# EAGLE design LMP848x Breakout v1.1 (EAGLE 8.3.2)
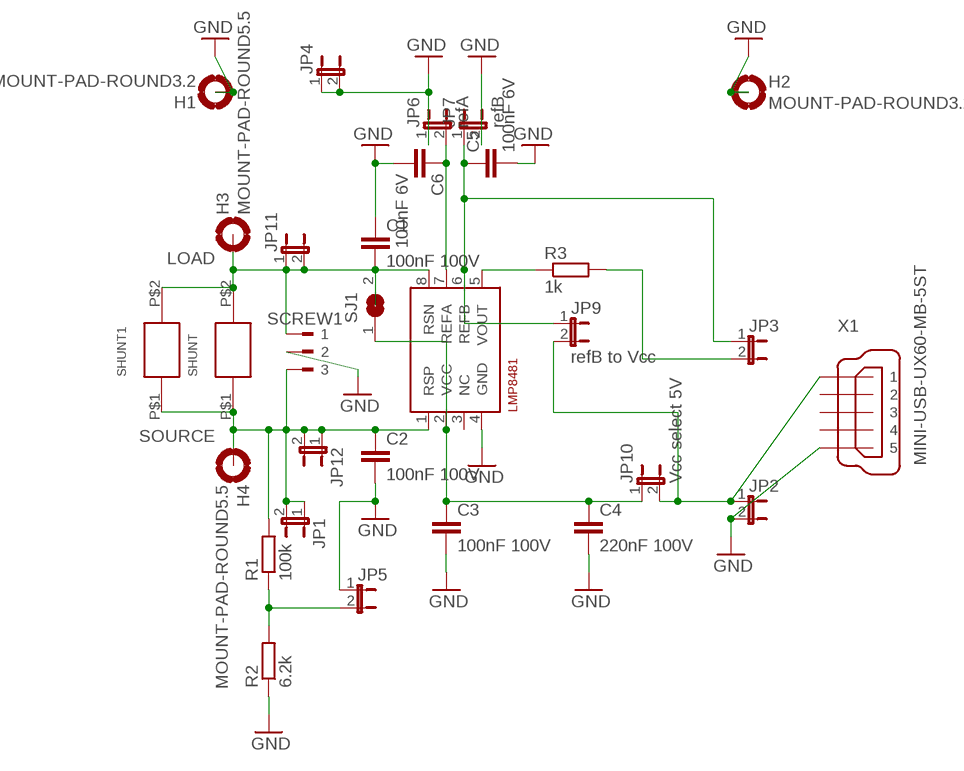
[diagram p0: schematic, sheet 1]

## Parts
C1  100nF 100V  C-EUC0805  [C0805]
C2  100nF 100V  C-EUC0805  [C0805]
C3  100nF 100V  C-EUC0805  [C0805]
C4  220nF 100V  C-EUC0805  [C0805]
C5  100nF 6V  C-EUC0805  [C0805]
C6  100nF 6V  C-EUC0805  [C0805]
H1  MOUNT-PAD-ROUND3.2  [3,2-PAD]
H2  MOUNT-PAD-ROUND3.2  [3,2-PAD]
H3  MOUNT-PAD-ROUND5.5  [5,5-PAD]
H4  MOUNT-PAD-ROUND5.5  [5,5-PAD]
JP1  JP1E  [JP1]
JP2  JP1E  [JP1]
JP3  JP1E  [JP1]
JP4  JP1E  [JP1]
JP5  JP1E  [JP1]
JP6  refA  JP1E  [JP1]
JP7  refB  JP1E  [JP1]
JP9  refB to Vcc  JP1E  [JP1]
JP10  Vcc select 5V  JP1E  [JP1]
JP11  JP1E  [JP1]
JP12  JP1E  [JP1]
LMP8481  LMP8481-H  [S-PDSO-G08]
R1  100k  R-EU_0207/7  [0207/7]
R2  6.2k  R-EU_0207/7  [0207/7]
R3  1k  R-EU_0204/5  [0204/5]
SCREW1  180-3  [180-3]
SHUNT  EBW_SERIES_15.2MM  [EBW_SERIES_15.2MM]
SHUNT1  EBW_SERIES_15.2MM  [EBW_SERIES_15.2MM]
SJ1  SJ  [SJ]
X1  MINI-USB-UX60-MB-5ST  [UX60-MB-5ST]

## Nets
GND: C1.1 C2.2 C3.2 C4.2 C5.2 C6.2 H1.B3,2(MOUNT) H2.B3,2(MOUNT) JP2.2 JP4.1 JP4.2 JP5.1 JP6.1 JP7.2 LMP8481.4(GND) R2.1 SCREW1.2 X1.5
LOAD: C1.2 H3.B5,5(MOUNT) JP11.1 JP11.2 LMP8481.8(RSN) SCREW1.1 SHUNT1.P$2 SHUNT.P$2 SJ1.2
N$1: C3.1 C4.1 JP10.1 LMP8481.2(VCC) SJ1.1
N$2: LMP8481.5(VOUT) R3.1
N$3: C5.1 JP3.1 JP7.1 JP9.1 LMP8481.6(REFB)
N$4: JP2.1 JP9.2 JP10.2 X1.1
N$5: JP3.2 R3.2
N$6: C6.1 JP6.2 LMP8481.7(REFA)
SOURCE: C2.1 H4.B5,5(MOUNT) JP1.1 JP1.2 JP12.1 JP12.2 LMP8481.1(RSP) R1.2 SCREW1.3 SHUNT1.P$1 SHUNT.P$1
VSENSE: JP5.2 R1.1 R2.2
Unconnected: LMP8481.3(NC) X1.2 X1.3 X1.4

## Library data of the parts
C1-C6 = rcl:C-EU: CAPACITOR, European symbol
H1-H4 = holes:MOUNT-PAD-ROUND: MOUNTING PAD, round
JP1-JP7 JP9-JP12 = jumper:JP1E: JUMPER
LMP8481 = LMP8481:LMP8481: LMP8481MM-H/NOPB 100V/V
R1-R3 = rcl:R-EU_: RESISTOR, European symbol
SCREW1 = con-weidmueller-sl35:180-3: WEIDMUELLER CLAMP CONNECTOR; OC_FARNELL: unknown; OC_NEWARK: unknown
SHUNT SHUNT1 = EBW series shunt:EBW_SERIES_15.2MM
SJ1 = jumper:SJ: SMD solder JUMPER
X1 = con-hirose:MINI-USB-: MINI USB Connector Source: http://www.hirose.co.jp/cataloge_hp/e24000019.pdf; OC_FARNELL: unknown; OC_NEWARK: unknown

## Net classes
2 thin_power: width 0.254 mm

## Board
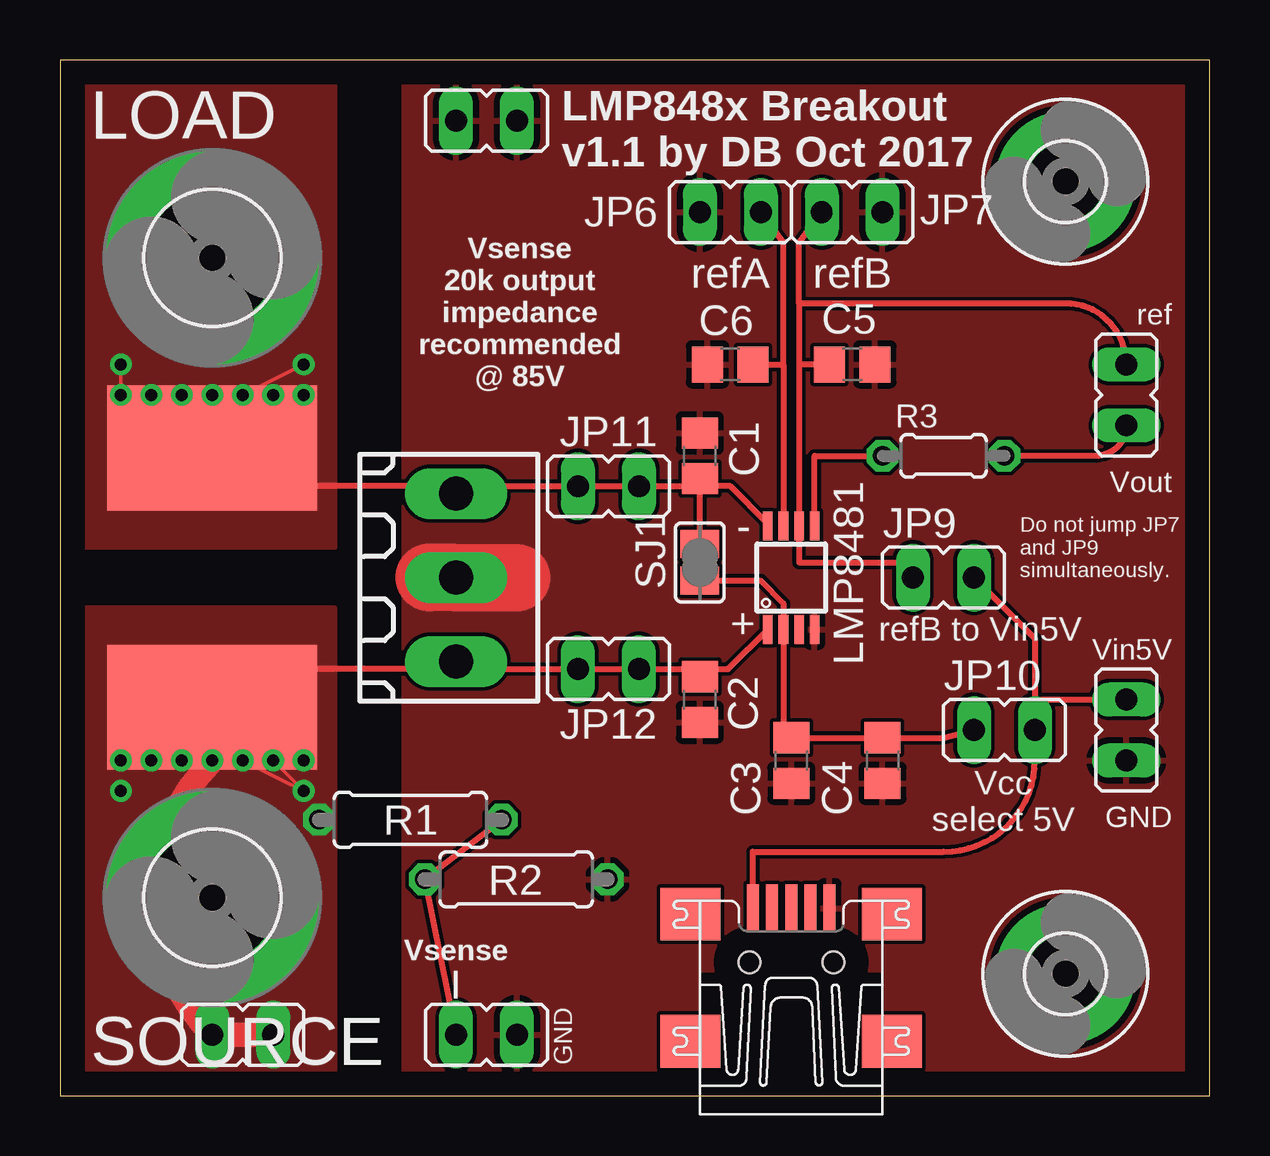
[diagram p1: board, top side]
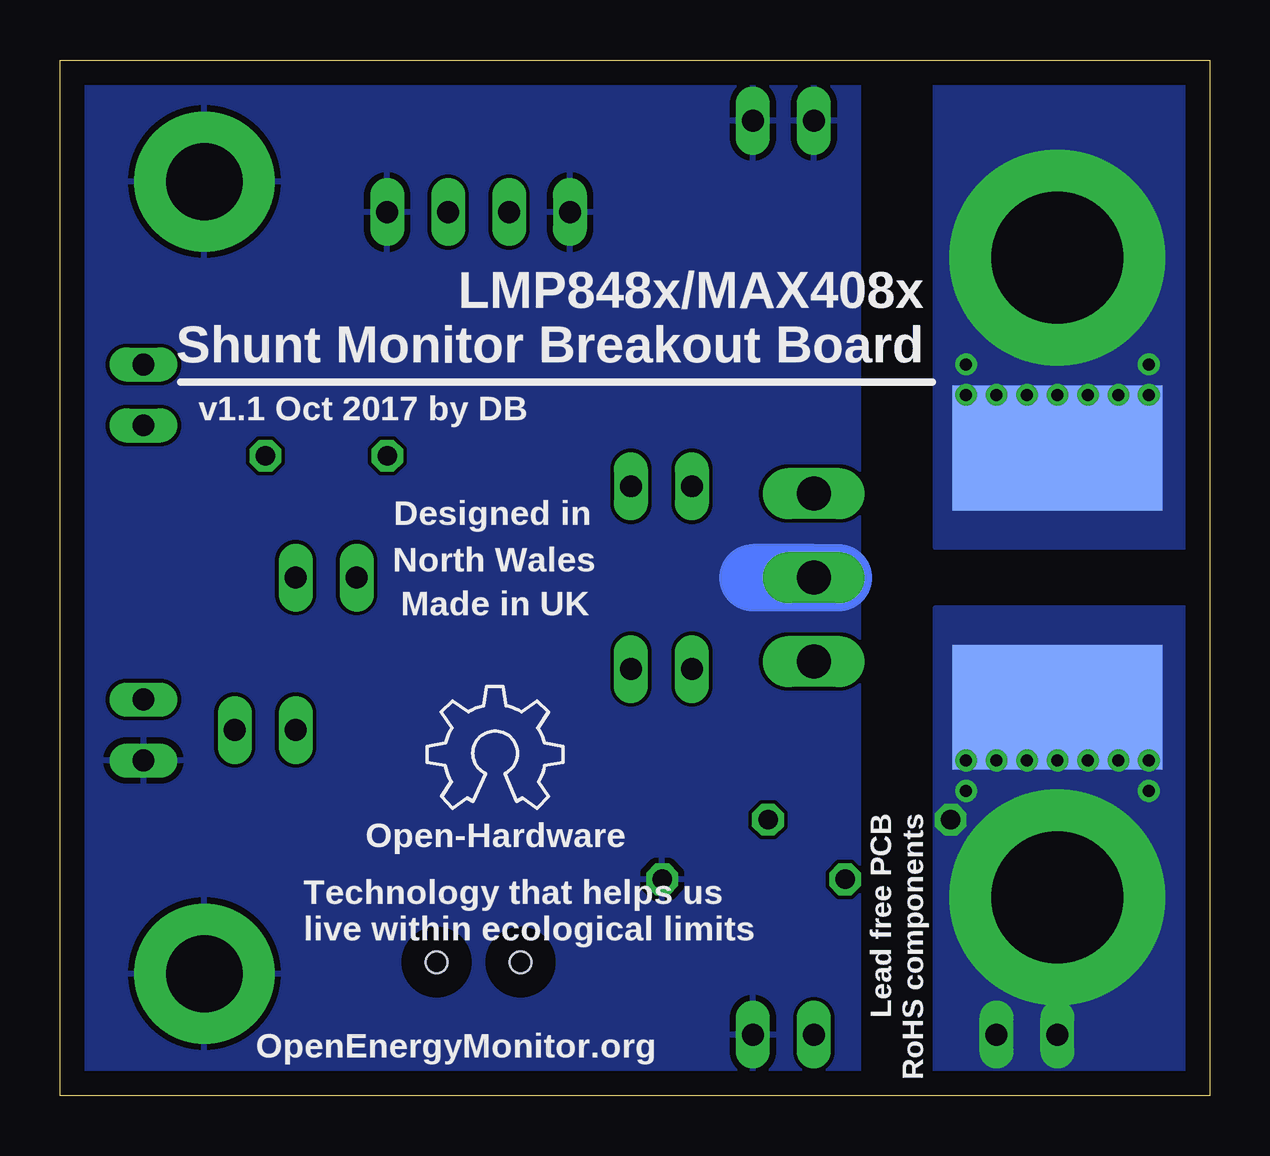
[diagram p2: board, bottom side, seen from below]

Size 47.93 x 43.17 mm. Coordinates in mm from the lower left corner, seen from the top.
Outline: 0,0 47.93,0 47.93,43.17 0,43.17 0,0
Copper layers (1*16): Top 0.035mm / dielectric 1.5mm / Bottom 0.035mm
Design rules "default *": minimum track width 10mil, minimum drill 0.5mm, track to track 6mil, track to pad 6mil, pad to pad 6mil, via to via 6mil, smd to smd 6mil, copper to edge 40mil, drill to drill 6mil, minimum pad ring 10mil, minimum via ring 8mil, stop-mask expansion 4mil, vias tented up to drill 0mil, thermal gap 10mil

### Footprints (pad centres in the part's own frame; a part is rotated, then mirrored left to right if it is on the bottom)
C0805 = smd 1.3 x 1.5: 1 -0.95,0; 2 0.95,0
3,2-PAD = drill 3.2 pad 5.842: B3,2 0,0
5,5-PAD = drill 5.5 pad 9: B5,5 0,0
JP1 = drill 0.914 long: 1 0,-1.27; 2 0,1.27
S-PDSO-G08 = smd 0.4 x 1.2: 1 -0.975,-2.157; 2 -0.325,-2.157; 3 0.325,-2.157; 4 0.975,-2.157; 5 0.975,2.157; 6 0.325,2.157; 7 -0.325,2.157; 8 -0.975,2.157
0207/7 = drill 0.813 octagon: 1 -3.81,0; 2 3.81,0
0204/5 = drill 0.813 octagon: 1 -2.54,0; 2 2.54,0
180-3 = drill 1.422 long: 1 -3.5,0; 2 0,0; 3 3.5,0
EBW_SERIES_15.2MM = smd 5.2 x 8.75: P$1 -5.4,0; P$2 5.4,0
SJ = smd 1.168 x 1.6: 1 -0.762,0; 2 0.762,0
UX60-MB-5ST = smd 2 x 0.5: 1 2.25,1.6; 2 2.25,0.8; 3 2.25,0; 4 2.25,-0.8; 5 2.25,-1.6 | smd 2.2 x 2.5: M1 -3.3,-4.2; M2 -3.3,4.2; M3 2,4.2; M4 2,-4.2 | hole 0.9: 0,-1.75; 0,1.75

### Placement (x,y rotation side)
C1  26.67,26.67 270 top
C2  26.67,16.51 270 top
C3  30.48,13.97 270 top
C4  34.29,13.97 270 top
C5  33.02,30.48 0 top
C6  27.94,30.48 180 top
H1  41.91,5.08 0 top
H2  41.91,38.1 0 top
H3  6.35,34.92 0 top
H4  6.35,8.26 0 top
JP1  7.62,2.54 90 top
JP2  44.45,15.24 180 top
JP3  44.45,29.21 180 top
JP4  17.78,40.64 90 top
JP5  17.78,2.54 90 top
JP6  27.94,36.83 270 top
JP7  33.02,36.83 270 top
JP9  36.83,21.59 270 top
JP10  39.37,15.24 270 top
JP11  22.86,25.4 270 top
JP12  22.86,17.78 90 top
LMP8481  30.48,21.59 0 top
LOGO1  OSHW_LOGO_6MILX0200-NT  [OSHW_6X200_NOTEXT]  32.64,11.98 0 bottom
R1  14.61,11.5 180 top
R2  19.02,9.01 180 top
R3  36.83,26.67 0 top
SCREW1  16.51,21.59 270 top
SHUNT  6.35,21.59 90 bottom
SHUNT1  6.35,21.59 90 top
SJ1  26.67,22.23 90 top
X1  30.48,5.56 90 top

### Tracks (layer width: path | path; a pad name or v marks a point on that pad's centre or on a via)
GND
  Top 2.794: 15.37,21.61 15.39,21.59 SCREW1.2 19.05,21.59
  Bottom 2.794: SCREW1.2 19.05,21.59 15.47,21.59
  pour Top: 14.3,43.21 46.99,43.18 46.99,0 14.3,0.03
  pour Bottom: 14.61,43.18 46.99,43.18 46.99,0 14.61,0
LOAD  (via drill 0.5)
  Top 0.152: v2.54,30.48 v2.54,29.21 3.49,26.99 SHUNT1.P$2 | SHUNT1.P$2 4.76,26.99 v3.81,29.21 | SHUNT1.P$2 6.03,26.99 v5.08,29.21 | SHUNT1.P$2 v6.35,29.21 | SHUNT1.P$2 9.21,26.99 v10.16,29.21 v8.89,29.21 7.94,26.99 SHUNT1.P$2 | SHUNT1.P$2 6.67,26.99 v7.62,29.21 v10.16,30.48
  Top 0.254: SHUNT1.P$2 7.94,25.4 15.24,25.4 | 15.24,25.4 JP11.1 JP11.2 26.67,25.4 | SCREW1.1 15.24,25.4 | SJ1.2 26.67,25.4 | LMP8481.8 29.5,23.84 27.94,25.4 26.67,25.4 | C1.2 26.67,25.4
  pour Top (no thermals): 0,43.18 11.43,43.18 11.43,22.86 0,22.86
  pour Bottom (no thermals): 11.43,43.18 0,43.18 0,22.86 11.43,22.86
N$1
  Top 0.254: JP10.1 36.83,14.92 C4.1 C3.1 30.16,14.92 LMP8481.2 30.16,20.52 29.21,21.46 SJ1.1
N$2
  Top 0.254: LMP8481.5 31.45,26.67 R3.1
N$3
  Top 0.254: 30.8,30.48 LMP8481.6 30.8,22.23 35.56,22.23 JP9.1 | 30.8,33.02 30.8,30.48 | 30.8,33.02 30.8,35.56 JP7.1 | C5.1 30.8,30.48 | JP3.1 arc90 41.91,33.02 30.8,33.02
N$4
  Top 0.254: JP10.2 arc-90 40.64,16.51 JP2.1 | JP9.2 40.64,19.05 JP10.2 | JP10.2 40.64,13.97 arc-90 36.83,10.16 28.88,10.16 X1.1
N$5
  Top 0.254: JP3.2 arc-90 43.18,26.67 R3.2
N$6
  Top 0.254: 30.16,30.48 30.16,35.56 JP6.2 | 30.16,30.48 LMP8481.7 | C6.1 30.16,30.48
SOURCE  (via drill 0.5)
  Top 0.152: SHUNT1.P$1 3.49,16.19 v2.54,13.97 | SHUNT1.P$1 4.76,16.19 v3.81,13.97 | SHUNT1.P$1 6.03,16.19 v5.08,13.97 | SHUNT1.P$1 v6.35,13.97 | SHUNT1.P$1 9.21,16.19 v10.16,13.97 | SHUNT1.P$1 7.94,16.19 v8.89,13.97 v10.16,12.7 v7.62,13.97 6.67,16.19 SHUNT1.P$1
  Top 0.254: 6.35,17.78 15.24,17.78 SCREW1.3 arc90 16.82,17.78 JP12.2 JP12.1 26.67,17.78 | LMP8481.1 27.85,17.78 26.67,17.78 | C2.1 26.67,17.78
  Top 1.016: v6.35,13.97 arc90 JP1.2 JP1.1
  other vias: 2.54,12.7
  pour Top (no thermals): 0,20.32 11.43,20.32 11.43,0 0,0
  pour Bottom (no thermals): 11.43,20.32 0,20.32 0,0 11.43,0
VSENSE
  Top 0.254: 16.51,3.85 JP5.2 R2.2 R1.1

### Text on the board
tPlace: Vsense / 20k output / impedance / recommended / @ 85V | Do not jump JP7 / and JP9 / simultaneously. | Vsense / | | GND
bPlace: LMP848x/MAX408x / Shunt Monitor Breakout Board | v1.1 Oct 2017 by DB | Designed in | North Wales | Made in UK | Lead free PCB / RoHS components | Open-Hardware | Technology that helps us / live within ecological limits | OpenEnergyMonitor.org
tNames: LOAD | LMP848x Breakout / v1.1 by DB Oct 2017 | refA | refB | ref | Vout | SJ1 | refB to Vin5V | Vin5V | Vcc / select 5V | GND | SOURCE
tValues: 47.93 | 43.17